# EAGLE design v1 (EAGLE 9.1.1)
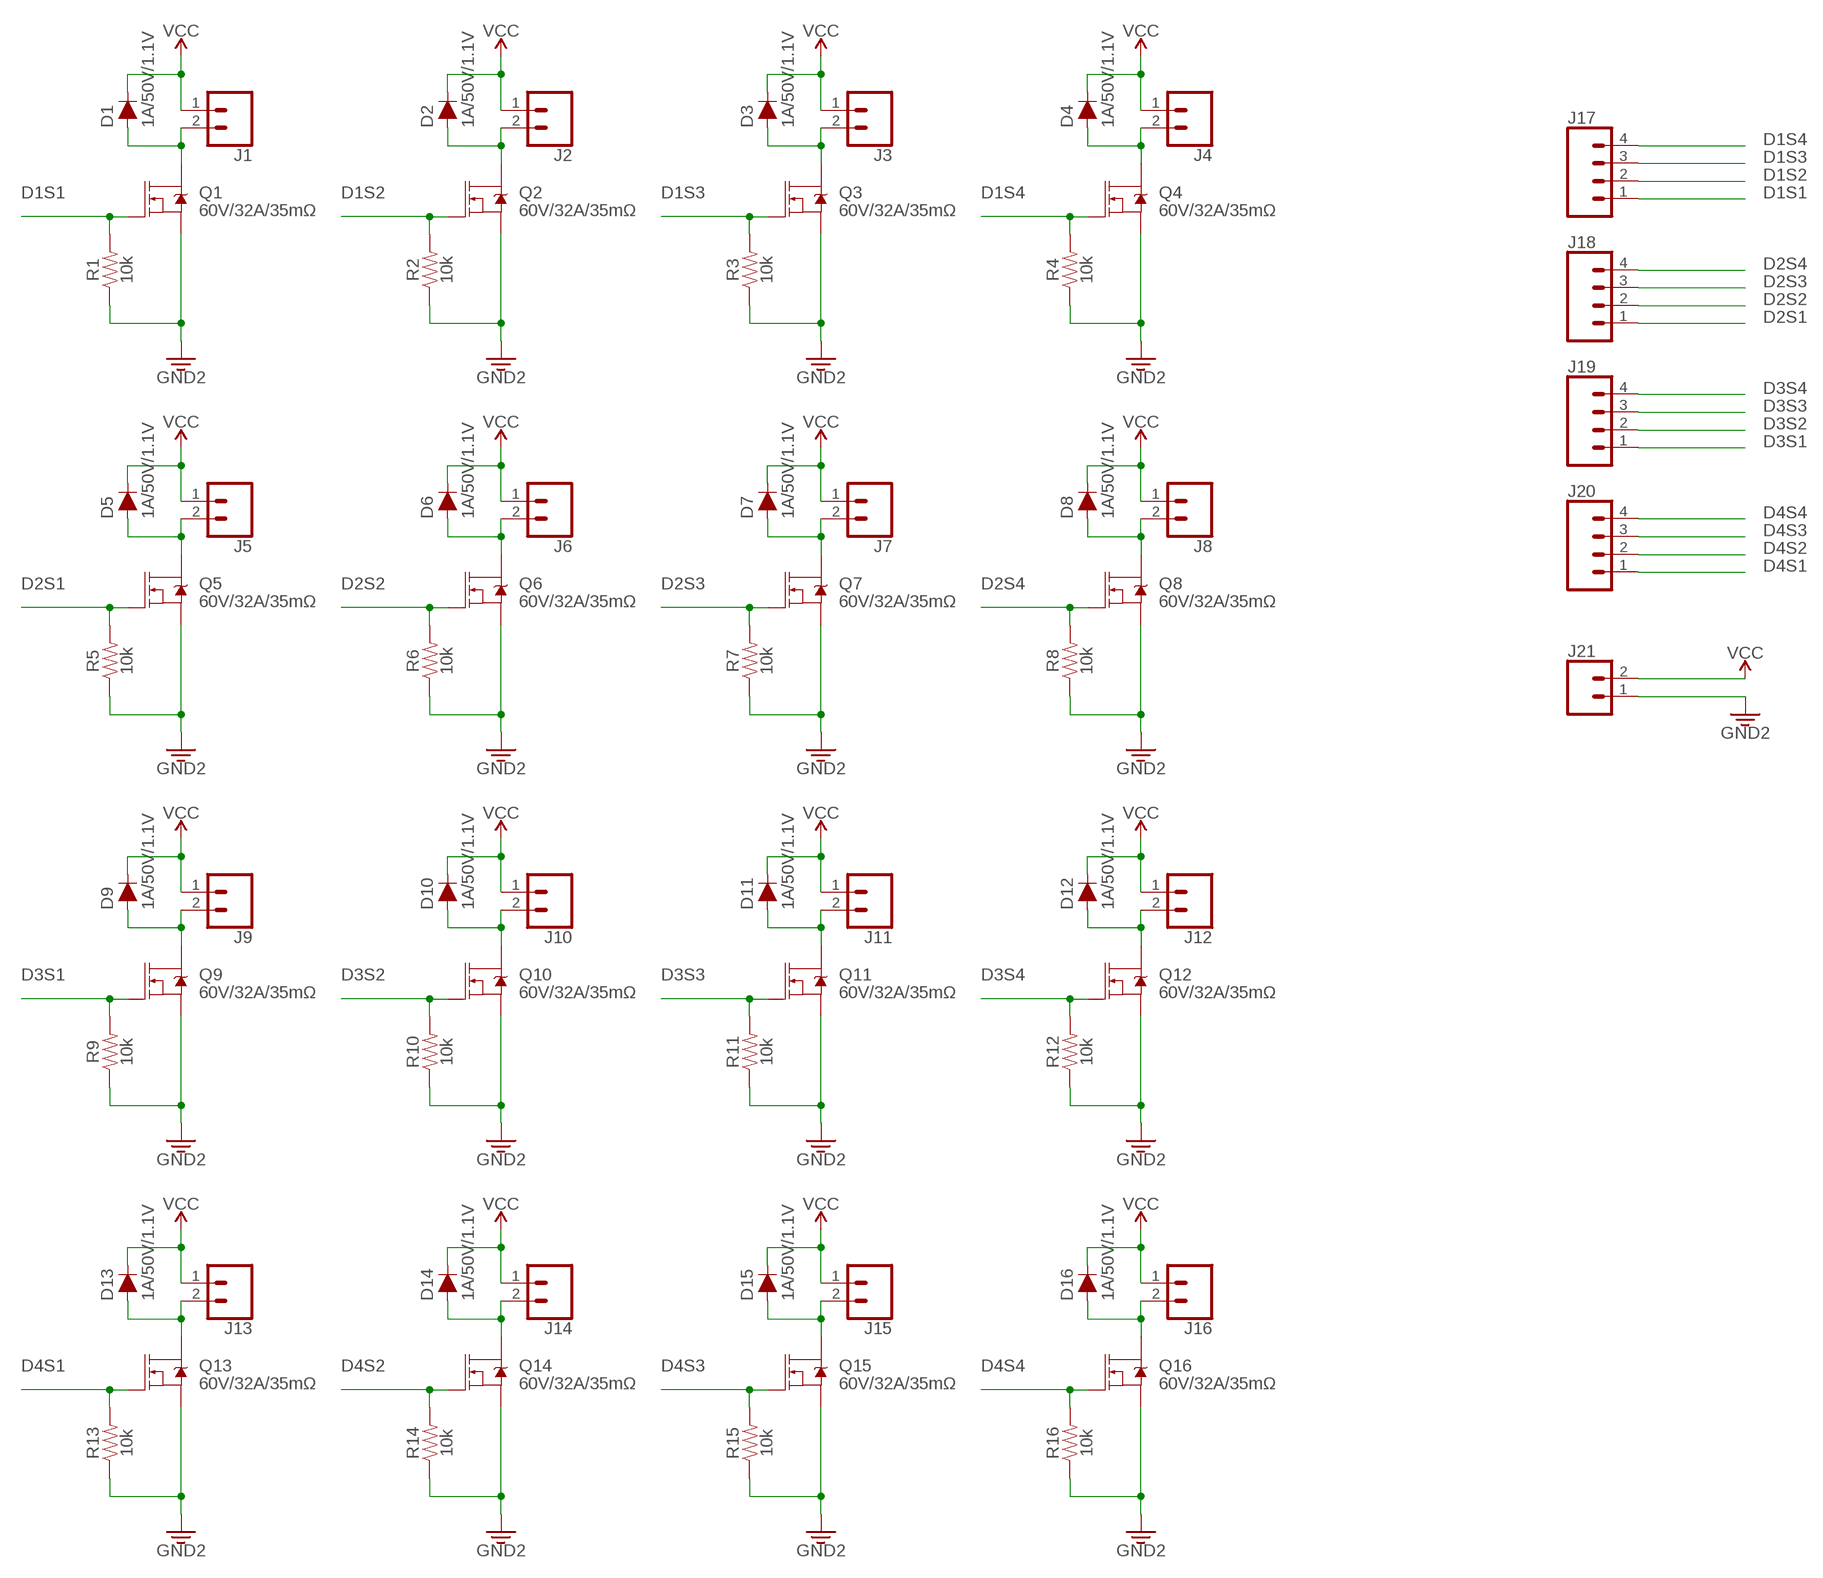
[diagram p0: schematic, sheet 1]

## Parts
D1  1A/50V/1.1V  DIODE-PTH  [DIODE-1N4001]
D2  1A/50V/1.1V  DIODE-PTH  [DIODE-1N4001]
D3  1A/50V/1.1V  DIODE-PTH  [DIODE-1N4001]
D4  1A/50V/1.1V  DIODE-PTH  [DIODE-1N4001]
D5  1A/50V/1.1V  DIODE-PTH  [DIODE-1N4001]
D6  1A/50V/1.1V  DIODE-PTH  [DIODE-1N4001]
D7  1A/50V/1.1V  DIODE-PTH  [DIODE-1N4001]
D8  1A/50V/1.1V  DIODE-PTH  [DIODE-1N4001]
D9  1A/50V/1.1V  DIODE-PTH  [DIODE-1N4001]
D10  1A/50V/1.1V  DIODE-PTH  [DIODE-1N4001]
D11  1A/50V/1.1V  DIODE-PTH  [DIODE-1N4001]
D12  1A/50V/1.1V  DIODE-PTH  [DIODE-1N4001]
D13  1A/50V/1.1V  DIODE-PTH  [DIODE-1N4001]
D14  1A/50V/1.1V  DIODE-PTH  [DIODE-1N4001]
D15  1A/50V/1.1V  DIODE-PTH  [DIODE-1N4001]
D16  1A/50V/1.1V  DIODE-PTH  [DIODE-1N4001]
J1  CONN_02  [1X02]
J2  CONN_02  [1X02]
J3  CONN_02  [1X02]
J4  CONN_02  [1X02]
J5  CONN_02  [1X02]
J6  CONN_02  [1X02]
J7  CONN_02  [1X02]
J8  CONN_02  [1X02]
J9  CONN_02  [1X02]
J10  CONN_02  [1X02]
J11  CONN_02  [1X02]
J12  CONN_02  [1X02]
J13  CONN_02  [1X02]
J14  CONN_02  [1X02]
J15  CONN_02  [1X02]
J16  CONN_02  [1X02]
J17  CONN_04JST-PTH-VERT  [JST-4-PTH-VERT]
J18  CONN_04JST-PTH-VERT  [JST-4-PTH-VERT]
J19  CONN_04JST-PTH-VERT  [JST-4-PTH-VERT]
J20  CONN_04JST-PTH-VERT  [JST-4-PTH-VERT]
J21  CONN_025MM  [SCREWTERMINAL-5MM-2]
Q1  60V/32A/35mΩ  MOSFET-NCH-FQP30N06L  [TO220V]
Q2  60V/32A/35mΩ  MOSFET-NCH-FQP30N06L  [TO220V]
Q3  60V/32A/35mΩ  MOSFET-NCH-FQP30N06L  [TO220V]
Q4  60V/32A/35mΩ  MOSFET-NCH-FQP30N06L  [TO220V]
Q5  60V/32A/35mΩ  MOSFET-NCH-FQP30N06L  [TO220V]
Q6  60V/32A/35mΩ  MOSFET-NCH-FQP30N06L  [TO220V]
Q7  60V/32A/35mΩ  MOSFET-NCH-FQP30N06L  [TO220V]
Q8  60V/32A/35mΩ  MOSFET-NCH-FQP30N06L  [TO220V]
Q9  60V/32A/35mΩ  MOSFET-NCH-FQP30N06L  [TO220V]
Q10  60V/32A/35mΩ  MOSFET-NCH-FQP30N06L  [TO220V]
Q11  60V/32A/35mΩ  MOSFET-NCH-FQP30N06L  [TO220V]
Q12  60V/32A/35mΩ  MOSFET-NCH-FQP30N06L  [TO220V]
Q13  60V/32A/35mΩ  MOSFET-NCH-FQP30N06L  [TO220V]
Q14  60V/32A/35mΩ  MOSFET-NCH-FQP30N06L  [TO220V]
Q15  60V/32A/35mΩ  MOSFET-NCH-FQP30N06L  [TO220V]
Q16  60V/32A/35mΩ  MOSFET-NCH-FQP30N06L  [TO220V]
R1  10k  10KOHM-HORIZ_KIT-1/4W-5%  [AXIAL-0.3-KIT]
R2  10k  10KOHM-HORIZ_KIT-1/4W-5%  [AXIAL-0.3-KIT]
R3  10k  10KOHM-HORIZ_KIT-1/4W-5%  [AXIAL-0.3-KIT]
R4  10k  10KOHM-HORIZ_KIT-1/4W-5%  [AXIAL-0.3-KIT]
R5  10k  10KOHM-HORIZ_KIT-1/4W-5%  [AXIAL-0.3-KIT]
R6  10k  10KOHM-HORIZ_KIT-1/4W-5%  [AXIAL-0.3-KIT]
R7  10k  10KOHM-HORIZ_KIT-1/4W-5%  [AXIAL-0.3-KIT]
R8  10k  10KOHM-HORIZ_KIT-1/4W-5%  [AXIAL-0.3-KIT]
R9  10k  10KOHM-HORIZ_KIT-1/4W-5%  [AXIAL-0.3-KIT]
R10  10k  10KOHM-HORIZ_KIT-1/4W-5%  [AXIAL-0.3-KIT]
R11  10k  10KOHM-HORIZ_KIT-1/4W-5%  [AXIAL-0.3-KIT]
R12  10k  10KOHM-HORIZ_KIT-1/4W-5%  [AXIAL-0.3-KIT]
R13  10k  10KOHM-HORIZ_KIT-1/4W-5%  [AXIAL-0.3-KIT]
R14  10k  10KOHM-HORIZ_KIT-1/4W-5%  [AXIAL-0.3-KIT]
R15  10k  10KOHM-HORIZ_KIT-1/4W-5%  [AXIAL-0.3-KIT]
R16  10k  10KOHM-HORIZ_KIT-1/4W-5%  [AXIAL-0.3-KIT]

## Nets
D1S1: J17.1 Q1.1(G) R1.P$2
D1S2: J17.2 Q2.1(G) R2.P$2
D1S3: J17.3 Q3.1(G) R3.P$2
D1S4: J17.4 Q4.1(G) R4.P$2
D2S1: J18.1 Q5.1(G) R5.P$2
D2S2: J18.2 Q6.1(G) R6.P$2
D2S3: J18.3 Q7.1(G) R7.P$2
D2S4: J18.4 Q8.1(G) R8.P$2
D3S1: J19.1 Q9.1(G) R9.P$2
D3S2: J19.2 Q10.1(G) R10.P$2
D3S3: J19.3 Q11.1(G) R11.P$2
D3S4: J19.4 Q12.1(G) R12.P$2
D4S1: J20.1 Q13.1(G) R13.P$2
D4S2: J20.2 Q14.1(G) R14.P$2
D4S3: J20.3 Q15.1(G) R15.P$2
D4S4: J20.4 Q16.1(G) R16.P$2
GND: J21.1 Q1.3(S) Q2.3(S) Q3.3(S) Q4.3(S) Q5.3(S) Q6.3(S) Q7.3(S) Q8.3(S) Q9.3(S) Q10.3(S) Q11.3(S) Q12.3(S) Q13.3(S) Q14.3(S) Q15.3(S) Q16.3(S) R1.P$1 R2.P$1 R3.P$1 R4.P$1 R5.P$1 R6.P$1 R7.P$1 R8.P$1 R9.P$1 R10.P$1 R11.P$1 R12.P$1 R13.P$1 R14.P$1 R15.P$1 R16.P$1 ; supply symbol labelled GND2
N$1: D13.A J13.2 Q13.2(D)
N$2: D14.A J14.2 Q14.2(D)
N$3: D1.A J1.2 Q1.2(D)
N$4: D2.A J2.2 Q2.2(D)
N$5: D15.A J15.2 Q15.2(D)
N$6: D3.A J3.2 Q3.2(D)
N$7: D16.A J16.2 Q16.2(D)
N$8: D4.A J4.2 Q4.2(D)
N$10: D5.A J5.2 Q5.2(D)
N$12: D6.A J6.2 Q6.2(D)
N$14: D7.A J7.2 Q7.2(D)
N$16: D8.A J8.2 Q8.2(D)
N$18: D9.A J9.2 Q9.2(D)
N$20: D10.A J10.2 Q10.2(D)
N$22: D11.A J11.2 Q11.2(D)
N$24: D12.A J12.2 Q12.2(D)
VCC: D1.C D2.C D3.C D4.C D5.C D6.C D7.C D8.C D9.C D10.C D11.C D12.C D13.C D14.C D15.C D16.C J1.1 J2.1 J3.1 J4.1 J5.1 J6.1 J7.1 J8.1 J9.1 J10.1 J11.1 J12.1 J13.1 J14.1 J15.1 J16.1 J21.2

## Library data of the parts
D1-D16 = SparkFun-DiscreteSemi:DIODE: Diode These are standard reverse protection diodes and small signal diodes. SparkFun Products: SparkFun SparkPunk Sound Kit <https://www.sparkfun.com/products/11177> SparkFun ESP8266 Thing <https://www.sparkfun.com/products/13231>; PROD_ID: DIO-09176
J1-J16 = SparkFun-Connectors:CONN_02: Multi connection point. Often used as Generic Header-pin footprint for 0.1 inch spaced/style header connections On any of the 0.1 inch spaced packages, you can populate with these: Break Away Headers - Straight <https://www.sparkfun.com/products/116> (PRT-00116) Break Away Male Headers - Right Angle <https://www.sparkfun.com/products/553> (PRT-00553) Female Headers <https://www.sparkfun.com/products/115> (PRT-00115) Break Away Headers - Machine Pin <https://www.sparkfun.com/products/117> (PRT-00117) Break Away Female Headers - Swiss Machine Pin <https://www.sparkfun.com/products/743> (PRT-00743) For SCREWTERMINALS and SPRING TERMINALS visit here: Screw Terimnals on SparkFun.com <https://www.sparkfun.com/search/results?term=Screw+Terminals> (5mm/3.5mm/2.54mm spacing) This device is also useful as a general connection point to wire up your design to another part of your project. Our various solder wires solder well into these plated through hole pads. Hook-Up Wire - Assortment (Stranded, 22 AWG) <https://www.sparkfun.com/products/11375> (PRT-11375) Hook-Up Wire - Assortment (Solid Core, 22 AWG) <https://www.sparkfun.com/products/11367> (PRT-11367) View the entire wire category on our website here <https://www.sparkfun.com/categories/141> Special notes: Molex polarized connector foot print use with: PRT-08233 with associated crimp pins and housings. 2.54_SCREWTERM for use with PRT-10571. 3.5mm Screw Terminal footprints for PRT-08084 5mm Screw Terminal footprints for use with PRT-08432
J17-J20 = SparkFun-Connectors:CONN_04: Multi connection point. Often used as Generic Header-pin footprint for 0.1 inch spaced/style header connections On any of the 0.1 inch spaced packages, you can populate with these: Break Away Headers - Straight <https://www.sparkfun.com/products/116> (PRT-00116) Break Away Male Headers - Right Angle <https://www.sparkfun.com/products/553> (PRT-00553) Female Headers <https://www.sparkfun.com/products/115> (PRT-00115) Break Away Headers - Machine Pin <https://www.sparkfun.com/products/117> (PRT-00117) Break Away Female Headers - Swiss Machine Pin <https://www.sparkfun.com/products/743> (PRT-00743) For SCREWTERMINALS and SPRING TERMINALS visit here: Screw Terimnals on SparkFun.com <https://www.sparkfun.com/search/results?term=Screw+Terminals> (5mm/3.5mm/2.54mm spacing) This device is also useful as a general connection point to wire up your design to another part of your project. Our various solder wires solder well into these plated through hole pads. Hook-Up Wire - Assortment (Stranded, 22 AWG) <https://www.sparkfun.com/products/11375> (PRT-11375) Hook-Up Wire - Assortment (Solid Core, 22 AWG) <https://www.sparkfun.com/products/11367> (PRT-11367) View the entire wire category on our website here <https://www.sparkfun.com/categories/141> Special notes: Molex polarized connector foot print use with SKU : PRT-08231 with associated crimp pins and housings. 1MM SMD Version SKU: PRT-10208; PROD_ID: CONN-13251
J21 = SparkFun-Connectors:CONN_02: Multi connection point. Often used as Generic Header-pin footprint for 0.1 inch spaced/style header connections On any of the 0.1 inch spaced packages, you can populate with these: Break Away Headers - Straight <https://www.sparkfun.com/products/116> (PRT-00116) Break Away Male Headers - Right Angle <https://www.sparkfun.com/products/553> (PRT-00553) Female Headers <https://www.sparkfun.com/products/115> (PRT-00115) Break Away Headers - Machine Pin <https://www.sparkfun.com/products/117> (PRT-00117) Break Away Female Headers - Swiss Machine Pin <https://www.sparkfun.com/products/743> (PRT-00743) For SCREWTERMINALS and SPRING TERMINALS visit here: Screw Terimnals on SparkFun.com <https://www.sparkfun.com/search/results?term=Screw+Terminals> (5mm/3.5mm/2.54mm spacing) This device is also useful as a general connection point to wire up your design to another part of your project. Our various solder wires solder well into these plated through hole pads. Hook-Up Wire - Assortment (Stranded, 22 AWG) <https://www.sparkfun.com/products/11375> (PRT-11375) Hook-Up Wire - Assortment (Solid Core, 22 AWG) <https://www.sparkfun.com/products/11367> (PRT-11367) View the entire wire category on our website here <https://www.sparkfun.com/categories/141> Special notes: Molex polarized connector foot print use with: PRT-08233 with associated crimp pins and housings. 2.54_SCREWTERM for use with PRT-10571. 3.5mm Screw Terminal footprints for PRT-08084 5mm Screw Terminal footprints for use with PRT-08432; SF_SKU: PRT-08432
Q1-Q16 = SparkFun-DiscreteSemi:MOSFET-NCH: N-channel MOSFETs Voltage controlled devices that allow control of high current outputs. SparkFun Products: SparkFun OpenScale <https://www.sparkfun.com/products/13261> SparkFun Digital Sandbox <https://www.sparkfun.com/products/12651> SparkFun Monster Moto Shield <https://www.sparkfun.com/products/10182> SparkFun MOSFET Power Controller <https://www.sparkfun.com/products/11214>; PROD_ID: TRANS-10060
R1-R16 = SparkFun-Resistors:10KOHM: 10kΩ resistor A resistor is a passive two-terminal electrical component that implements electrical resistance as a circuit element. Resistors act to reduce current flow, and, at the same time, act to lower voltage levels within circuits. - Wikipedia; PROD_ID: RES-09435

## Board
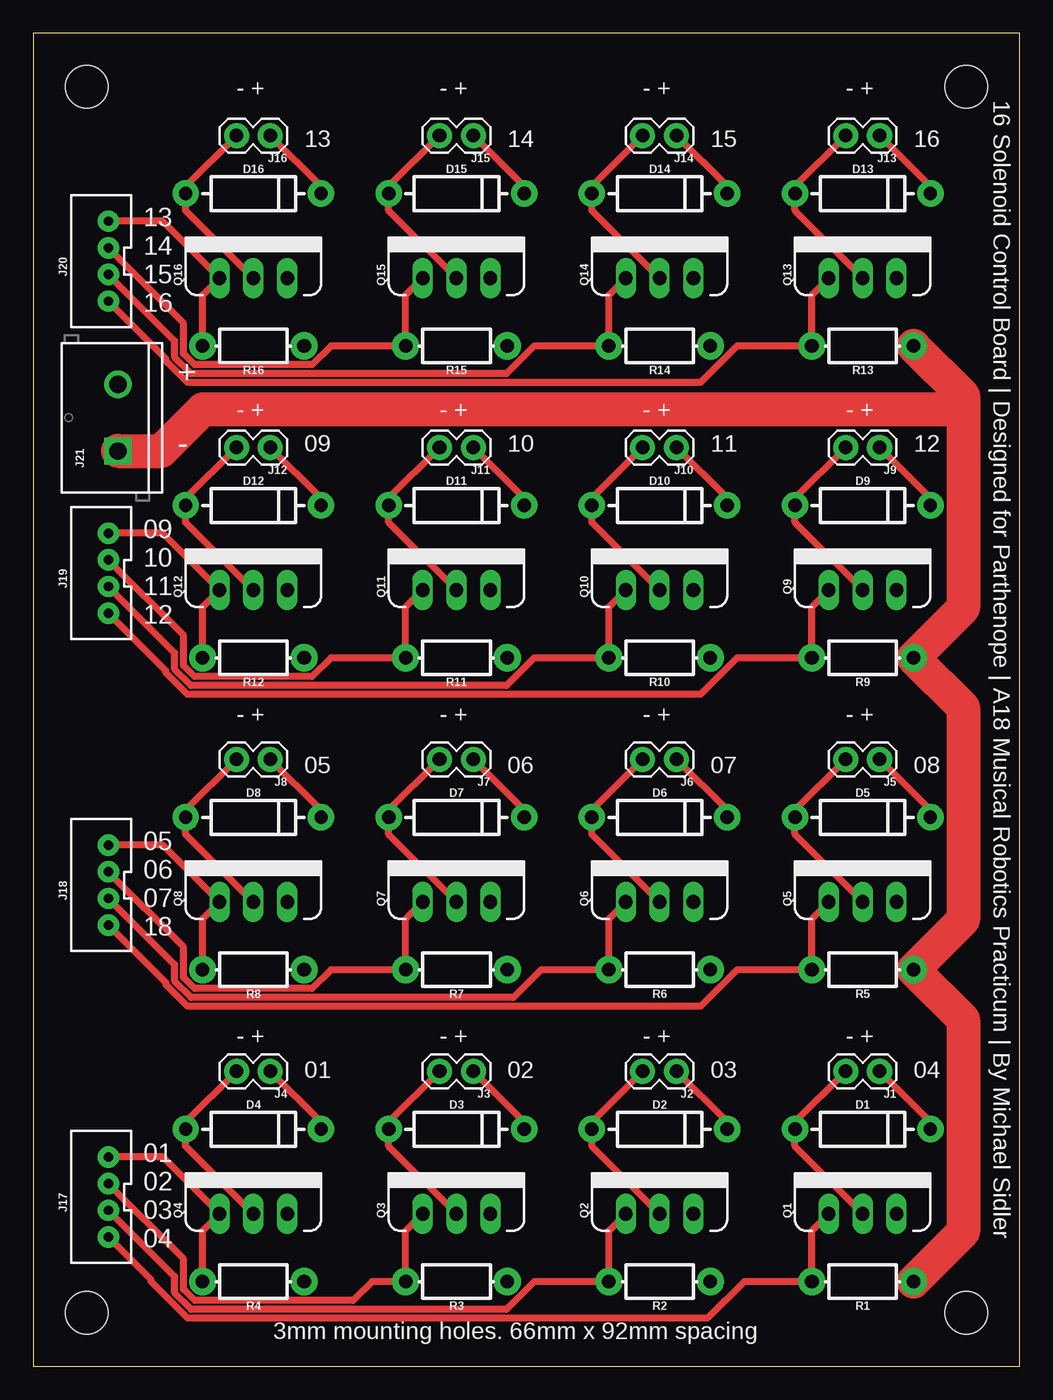
[diagram p1: board, top side]
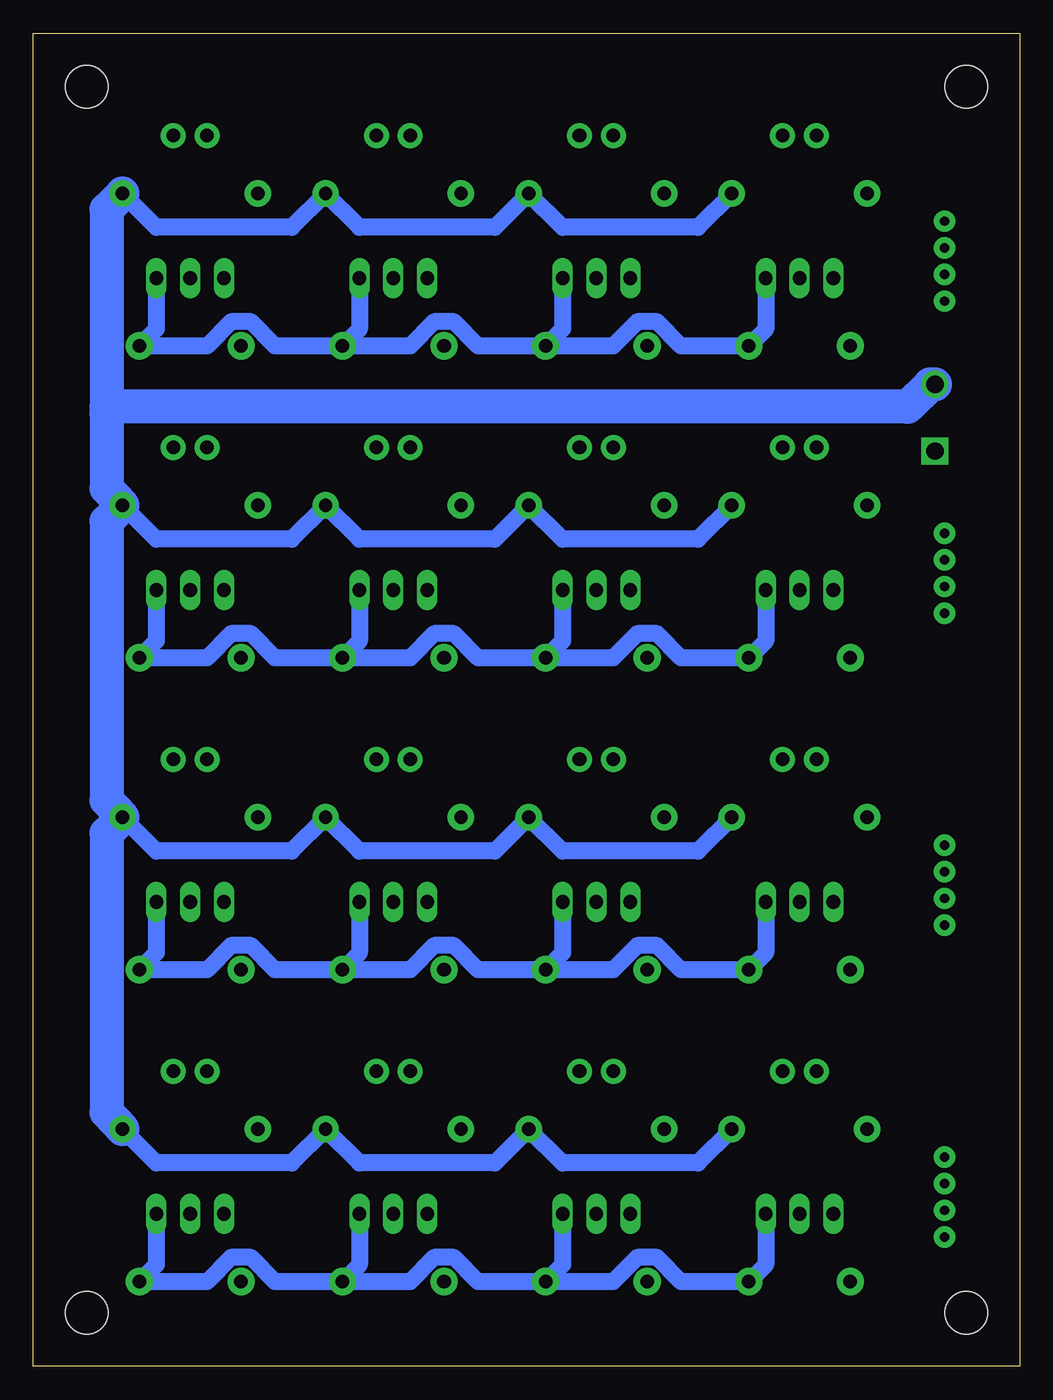
[diagram p2: board, bottom side, seen from below]

Size 74 x 100 mm. Coordinates in mm from the lower left corner, seen from the top.
Outline: 0,0 74,0 74,100 0,100 0,0
Copper layers (1*16): Top 0.035mm / dielectric 1.5mm / Bottom 0.035mm
Design rules "default": minimum track width 6mil, minimum drill 0.35mm, track to track 6mil, track to pad 6mil, pad to pad 6mil, via to via 6mil, smd to smd 6mil, copper to edge 40mil, drill to drill 6mil, minimum pad ring 10mil, minimum via ring 8mil, stop-mask expansion 4mil, vias tented up to drill 0mil, thermal gap 10mil
Holes 3.2 mm at 4,96 70,96 70,4 4,4

### Footprints (pad centres in the part's own frame; a part is rotated, then mirrored left to right if it is on the bottom)
DIODE-1N4001 = drill 1 pad 1.981: A -5.08,0; C 5.08,0
1X02 = drill 1.016 pad 1.88: 1 0,0; 2 2.54,0
JST-4-PTH-VERT = drill 0.7 pad 1.6: 1 -3,-0.55; 2 -1,-0.55; 3 1,-0.55; 4 3,-0.55
SCREWTERMINAL-5MM-2 = drill 1.3 pad 2.032 square: 1 0,0 | drill 1.3 pad 2.032: 2 5,0
TO220V = drill 1.016 long: 1 -2.54,0; 2 0,0; 3 2.54,0
AXIAL-0.3-KIT = drill 1.016 pad 2.032: P$1 -3.81,0; P$2 3.81,0

### Placement (x,y rotation side)
D1  62.23,17.78 0 top
D2  46.99,17.78 0 top
D3  31.75,17.78 0 top
D4  16.51,17.78 0 top
D5  62.23,41.18 0 top
D6  46.99,41.18 0 top
D7  31.75,41.18 0 top
D8  16.51,41.18 0 top
D9  62.23,64.58 0 top
D10  46.99,64.58 0 top
D11  31.75,64.58 0 top
D12  16.51,64.58 0 top
D13  62.23,87.98 0 top
D14  46.99,87.98 0 top
D15  31.75,87.98 0 top
D16  16.51,87.98 0 top
J1  63.5,22.13 180 top
J2  48.26,22.13 180 top
J3  33.02,22.13 180 top
J4  17.78,22.13 180 top
J5  63.5,45.53 180 top
J6  48.26,45.53 180 top
J7  33.02,45.53 180 top
J8  17.78,45.53 180 top
J9  63.5,68.93 180 top
J10  48.26,68.93 180 top
J11  33.02,68.93 180 top
J12  17.78,68.93 180 top
J13  63.5,92.33 180 top
J14  48.26,92.33 180 top
J15  33.02,92.33 180 top
J16  17.78,92.33 180 top
J17  5.08,12.7 90 top
J18  5.08,36.1 90 top
J19  5.08,59.5 90 top
J20  5.08,82.9 90 top
J21  6.35,68.66 90 top
Q1  62.23,11.43 0 top
Q2  46.99,11.43 0 top
Q3  31.75,11.43 0 top
Q4  16.51,11.43 0 top
Q5  62.23,34.83 0 top
Q6  46.99,34.83 0 top
Q7  31.75,34.83 0 top
Q8  16.51,34.83 0 top
Q9  62.23,58.23 0 top
Q10  46.99,58.23 0 top
Q11  31.75,58.23 0 top
Q12  16.51,58.23 0 top
Q13  62.23,81.63 0 top
Q14  46.99,81.63 0 top
Q15  31.75,81.63 0 top
Q16  16.51,81.63 0 top
R1  62.23,6.35 180 top
R2  46.99,6.35 180 top
R3  31.75,6.35 180 top
R4  16.51,6.35 180 top
R5  62.23,29.75 180 top
R6  46.99,29.75 180 top
R7  31.75,29.75 180 top
R8  16.51,29.75 180 top
R9  62.23,53.15 180 top
R10  46.99,53.15 180 top
R11  31.75,53.15 180 top
R12  16.51,53.15 180 top
R13  62.23,76.55 180 top
R14  46.99,76.55 180 top
R15  31.75,76.55 180 top
R16  16.51,76.55 180 top

### Tracks (layer width: path | path; a pad name or v marks a point on that pad's centre or on a via)
D1S1
  Top 0.508: Q1.1 58.42,10.16 R1.P$2 53.34,6.35 50.6,3.61 11.56,3.61 8.84,6.33 8.84,6.49 J17.1
D1S2
  Top 0.508: Q2.1 43.18,10.16 R2.P$2 37.57,6.35 35.49,4.27 11.84,4.27 10.62,5.49 10.62,6.71 J17.2
D1S3
  Top 0.508: Q3.1 27.94,10.16 R3.P$2 25.4,6.35 23.98,4.93 12.11,4.93 11.28,5.76 11.28,8.05 J17.3
D1S4
  Top 0.508: R4.P$2 12.7,10.16 Q4.1 9.7,15.7 J17.4
D2S1
  Top 0.508: Q5.1 58.42,33.56 R5.P$2 52.81,29.75 50.07,27.01 11.56,27.01 9.96,28.61 9.96,28.77 J18.1
D2S2
  Top 0.508: Q6.1 43.18,33.56 R6.P$2 38.1,29.75 36.02,27.67 11.84,27.67 10.62,28.89 10.62,30.11 J18.2
D2S3
  Top 0.508: Q7.1 27.94,33.56 R7.P$2 22.33,29.75 22.33,29.74 20.91,28.33 12.11,28.33 11.28,29.16 11.28,31.45 J18.3
D2S4
  Top 0.508: R8.P$2 12.7,33.56 Q8.1 9.7,39.1 J18.4
D3S1
  Top 0.508: Q9.1 58.42,56.96 R9.P$2 52.81,53.15 50.07,50.41 11.56,50.41 9.96,52.01 9.96,52.17 J19.1
D3S2
  Top 0.508: Q10.1 43.18,56.96 R10.P$2 37.57,53.15 35.49,51.07 11.84,51.07 10.62,52.29 10.62,53.51 J19.2
D3S3
  Top 0.508: Q11.1 27.94,56.96 R11.P$2 22.33,53.15 20.91,51.73 12.11,51.73 11.28,52.56 11.28,54.85 J19.3
D3S4
  Top 0.508: R12.P$2 12.7,56.96 Q12.1 9.7,62.5 J19.4
D4S1
  Top 0.508: Q13.1 58.42,80.36 R13.P$2 52.81,76.55 50.07,73.81 11.56,73.81 9.96,75.41 9.96,75.57 J20.1
D4S2
  Top 0.508: Q14.1 43.18,80.36 R14.P$2 37.57,76.55 35.49,74.47 11.84,74.47 10.62,75.69 10.62,76.91 J20.2
D4S3
  Top 0.508: Q15.1 27.94,80.36 R15.P$2 22.33,76.55 20.91,75.13 12.11,75.13 11.28,75.96 11.28,78.25 J20.3
D4S4
  Top 0.508: R16.P$2 12.7,80.36 Q16.1 9.7,85.9 J20.4
GND
  Top 2.54: R13.P$1 69.77,72.82 69.77,71.8 | R1.P$1 69.77,10.08 69.77,26.02 R5.P$1 69.77,33.48 69.77,49.42 R9.P$1 69.77,56.88 69.77,71.47 69.77,71.8 | J21.1 9.6,68.66 12.74,71.8 69.77,71.8
  Bottom 1.27: Q12.3 19.05,54.42 R12.P$1 25.39,53.15 27.19,54.95 28.69,54.95 30.49,53.15 R11.P$1 | Q11.3 34.29,54.42 R11.P$1 | Q10.3 49.53,54.42 R10.P$1 | Q9.3 64.77,54.42 R9.P$1 60.97,53.15 59.17,54.95 57.67,54.95 55.87,53.15 R10.P$1 | R11.P$1 40.63,53.15 42.43,54.95 43.93,54.95 45.73,53.15 R10.P$1 | R7.P$1 30.49,29.75 28.69,31.55 27.19,31.55 25.39,29.75 R8.P$1 19.05,31.02 Q8.3 | R7.P$1 40.63,29.75 42.43,31.55 43.93,31.55 45.73,29.75 R6.P$1 | R6.P$1 55.87,29.75 57.67,31.55 59.17,31.55 60.97,29.75 R5.P$1 64.77,31.02 Q5.3 | Q7.3 34.29,31.02 R7.P$1 | Q6.3 49.53,31.02 R6.P$1 | Q4.3 19.05,7.62 R4.P$1 25.39,6.35 27.19,8.15 28.69,8.15 30.49,6.35 R3.P$1 | Q3.3 34.29,7.62 R3.P$1 | Q2.3 49.53,7.62 R2.P$1 | Q1.3 64.77,7.62 R1.P$1 60.97,6.35 59.17,8.15 57.67,8.15 55.87,6.35 R2.P$1 | R3.P$1 40.63,6.35 42.43,8.15 43.93,8.15 45.73,6.35 R2.P$1 | Q16.3 19.05,77.82 R16.P$1 25.39,76.55 27.19,78.35 28.69,78.35 30.49,76.55 R15.P$1 | Q15.3 34.29,77.82 R15.P$1 | Q14.3 49.53,77.82 R14.P$1 | Q13.3 64.77,77.82 R13.P$1 60.97,76.55 59.17,78.35 57.67,78.35 55.87,76.55 R14.P$1 | R15.P$1 40.63,76.55 42.43,78.35 43.93,78.35 45.73,76.55 R14.P$1
N$1
  Top 0.508: J13.2 57.15,88.52 D13.A 57.15,86.71 Q13.2
N$2
  Top 0.508: J14.2 41.91,88.52 D14.A 41.91,86.71 Q14.2
N$3
  Top 0.508: J1.2 57.15,18.32 D1.A 57.15,16.51 Q1.2
N$4
  Top 0.508: J2.2 41.91,18.32 D2.A 41.91,16.51 Q2.2
N$5
  Top 0.508: J15.2 26.67,88.52 D15.A 26.67,86.71 Q15.2
N$6
  Top 0.508: J3.2 26.67,18.32 D3.A 26.67,16.51 Q3.2
N$7
  Top 0.508: J16.2 11.43,88.52 D16.A 11.43,86.71 Q16.2
N$8
  Top 0.508: J4.2 11.43,18.32 D4.A 11.43,16.51 Q4.2
N$10
  Top 0.508: J5.2 57.15,41.72 D5.A 57.15,39.91 Q5.2
N$12
  Top 0.508: J6.2 41.91,41.72 D6.A 41.91,39.91 Q6.2
N$14
  Top 0.508: J7.2 26.67,41.72 D7.A 26.67,39.91 Q7.2
N$16
  Top 0.508: J8.2 11.43,41.72 D8.A 11.43,39.91 Q8.2
N$18
  Top 0.508: J9.2 57.15,65.12 D9.A 57.15,63.31 Q9.2
N$20
  Top 0.508: J10.2 41.91,65.12 D10.A 41.91,63.31 Q10.2
N$22
  Top 0.508: J11.2 26.67,65.12 D11.A 26.67,63.31 Q11.2
N$24
  Top 0.508: J12.2 11.43,65.12 D12.A 11.43,63.31 Q12.2
VCC
  Top 0.508: D16.C 21.59,88.52 J16.1 | D15.C 36.83,88.52 J15.1 | D14.C 52.07,88.52 J14.1 | D13.C 67.31,88.52 J13.1 | D12.C 21.59,65.12 J12.1 | D11.C 36.83,65.12 J11.1 | D10.C 52.07,65.12 J10.1 | D9.C 67.31,65.12 J9.1 | D8.C 21.59,41.72 J8.1 | D7.C 36.83,41.72 J7.1 | D6.C 52.07,41.72 J6.1 | D5.C 67.31,41.72 J5.1 | D4.C 21.59,18.32 J4.1 | D3.C 36.83,18.32 J3.1 | D2.C 52.07,18.32 J2.1 | D1.C 67.31,18.32 J1.1
  Bottom 1.27: D4.C 24.13,15.24 34.29,15.24 D3.C 39.37,15.24 49.53,15.24 D2.C 54.61,15.24 64.77,15.24 D1.C | D8.C 24.13,38.64 34.29,38.64 D7.C 39.37,38.64 49.53,38.64 D6.C 54.61,38.64 64.77,38.64 D5.C | D12.C 24.13,62.04 34.29,62.04 D11.C 39.37,62.04 49.53,62.04 D10.C 54.61,62.04 64.77,62.04 D9.C | D16.C 24.13,85.44 34.29,85.44 D15.C 39.37,85.44 49.53,85.44 D14.C 54.61,85.44 64.77,85.44 D13.C
  Bottom 2.54: D13.C 68.5,86.79 68.5,71.98 | D1.C 68.5,19.05 68.5,39.99 D5.C 68.5,42.45 68.5,63.39 D9.C 68.5,65.85 68.5,71.47 68.5,71.98 | J21.2 6.7,73.66 8.38,71.98 68.5,71.98

### Text on the board
tPlace: - + | - + | - + | - + | 16 Solenoid Control Board | Designed for Parthenope | A18 Musical Robotics Practicum | By Michael Sidler | 13 | 14 | 15 | 16 | 13 / 14 / 15 / 16 | - + | - + | - + | - + | 09 | 10 | 11 | 12 | + / / - | 09 / 10 / 11 / 12 | - + | - + | - + | - + | 05 | 06 | 07 | 08 | 05 / 06 / 07 / 18 | - + | - + | - + | - + | 01 | 02 | 03 | 04 | 01 / 02 / 03 / 04 | 3mm mounting holes. 66mm x 92mm spacing